# EasyEDA Pro project 无线充电接收端.eprj

# Schematic Schematic1
Board Name: Board1; Create Date: 2023-04-21; Page Name: P1; Project Name: 无线充电接收端; Schematic Name: Schematic1; Update Date: 2025-04-24; Company: 嘉立创EDA; Page Size: A4; Version: V1.0
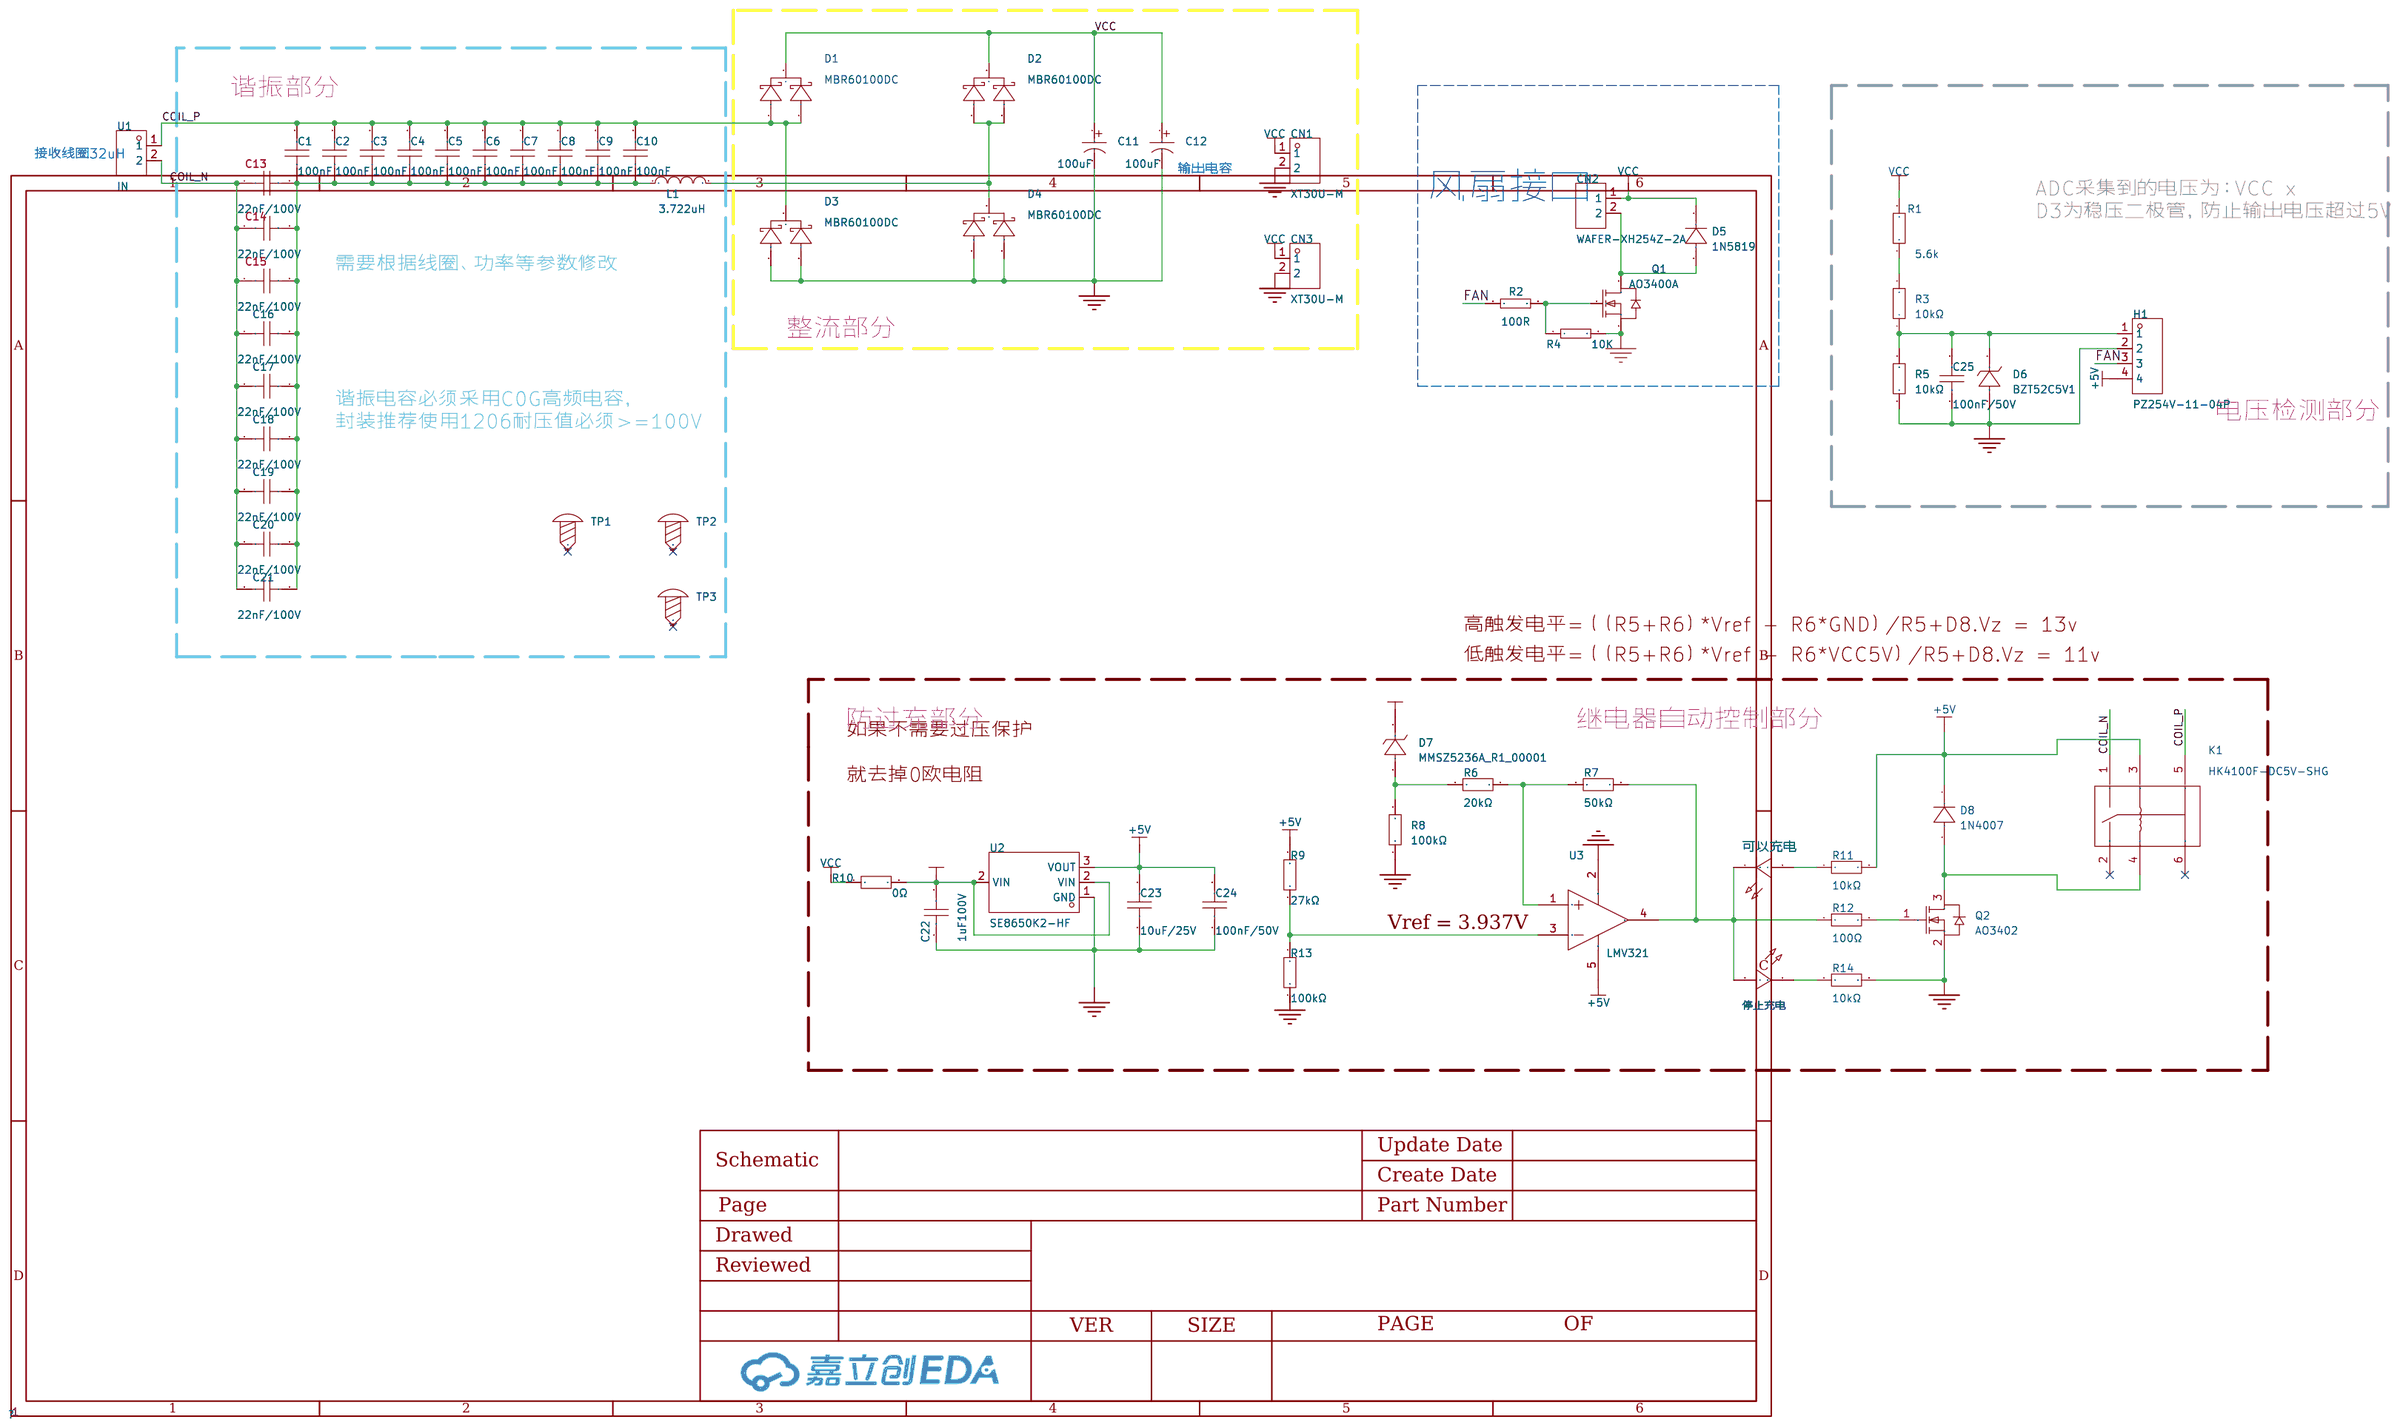
[diagram p0: schematic sheet]

## Parts
C1  100nF  [C1206]
C2  100nF  [C1206]
C3  100nF  [C1206]
C4  100nF  [C1206]
C5  100nF  [C1206]
C6  100nF  [C1206]
C7  100nF  [C1206]
C8  100nF  [C1206]
C9  100nF  [C1206]
C10  100nF  [C1206]
C11  100uF  [CAP-TH_BD10.0-P5.00-D1.0-FD]
C12  100uF  [CAP-TH_BD10.0-P5.00-D1.0-FD]
C13  22nF/100V  [C1206]
C14  22nF/100V  [C1206]
C15  22nF/100V  [C1206]
C16  22nF/100V  [C1206]
C17  22nF/100V  [C1206]
C18  22nF/100V  [C1206]
C19  22nF/100V  [C1206]
C20  22nF/100V  [C1206]
C21  22nF/100V  [C1206]
C22  1uF100V  [C1206]
C23  10uF/25V  [C1206]
C24  100nF/50V  [C0603]
C25  100nF/50V  [C0603]
CN1  XT30U-M  [CONN-TH_XT30U-M]
CN2  WAFER-XH254Z-2A  [CONN-TH_2P-P2.50_XH-2A_3045048]
CN3  XT30U-M  [CONN-TH_XT30U-M]
D1  MBR60100DC  [TO-263-3_L10.2-W9.0-P5.08-LS15.2-BR]
D2  MBR60100DC  [TO-263-3_L10.2-W9.0-P5.08-LS15.2-BR]
D3  MBR60100DC  [TO-263-3_L10.2-W9.0-P5.08-LS15.2-BR]
D4  MBR60100DC  [TO-263-3_L10.2-W9.0-P5.08-LS15.2-BR]
D5  1N5819  [SMA_L4.3-W2.6-LS5.1-RD]
D6  BZT52C5V1  [SOD-123_L2.7-W1.6-LS3.7-RD]
D7  MMSZ5236A_R1_00001  [SOD-123F_L2.7-W1.6-LS3.8-RD-1]
D8  1N4007  [SMA_L4.3-W2.5-LS5.0-RD]
H1  PZ254V-11-04P  [HDR-TH_4P-P2.54-V-M]
K1  HK4100F-DC5V-SHG  [RELAY-TH_HK4100F-DC5V-SHG]
L1  3.722uH  [T106-2]
Q1  AO3400A  [SOT-23-3_L2.9-W1.3-P1.90-LS2.4-BR]
Q2  AO3402  [SOT-23-3_L3.0-W1.7-P0.95-LS2.9-BR]
R1  5.6k  [R0603]
R2  100R  [R0603]
R3  10kΩ  [R0603]
R4  10K  [R0603]
R5  10kΩ  [R0603]
R6  20kΩ  [R0603]
R7  50kΩ  [R0603]
R8  100kΩ  [R0603]
R9  27kΩ  [R0603]
R10  0Ω  [R0603]
R11  10kΩ  [R0603]
R12  100Ω  [R0603]
R13  100kΩ  [R0603]
R14  10kΩ  [R0603]
TP1  -  [孔]
TP2  -  [孔]
TP3  -  [孔]
U1  IN  [CONN-TH_P5.00_KF301-5.0-2P]
U2  SE8650K2-HF  [SOT-89-3_L4.5-W2.5-P1.50-LS4.2-BR]
U3  LMV321  [SOT-23-5_L3.0-W1.5-P0.80-LS3.0-BL]
停止充电  -  [LED_0603]
可以充电  -  [LED_0603]

## Library data of the parts
C1-C10 = GRM31C5C2A104JA01L: 容值:100nF;精度:±5%;额定电压:100V;材质(温度系数):C0G;; LCSC Part Name: 100nF ±5% 100V; Supplier Part: C405303; Manufacturer: muRata(村田); Supplier Footprint: 1206; JLCPCB Part Class: Extended Part; Datasheet: https://atta.szlcsc.com/upload/public/pdf/source/20190717/C405303_DB26B790B590E67035A9C43E8E89903F.pdf; Supplier: LCSC; Tolerance: ±5%; Voltage Rated: 100V; Temperature Coefficient: C0G
C11 C12 = 100PX100MEFC10X16: 容值:100uF;精度:±20%;额定电压:100V;纹波电流:400mA@100kHz;等效串联电阻:-;; LCSC Part Name: 100uF ±20% 100V; Supplier Part: C88775; Manufacturer: rubycon(红宝石); Supplier Footprint: 插件,D10xL16mm; JLCPCB Part Class: Extended Part; Datasheet: https://atta.szlcsc.com/upload/public/pdf/source/20161125/1480067888294.pdf; Supplier: LCSC; Tolerance: ±20%; Rated Voltage: 100V; φD: 10mm; L: 16mm; Lead Spacing: 5mm; Ripple Current: 400mA@100kHz; Lifetime @ Temp: 2000hrs@105℃
C13-C21 = GRM31C5C2A104JA01L: 容值:100nF;精度:±5%;额定电压:100V;材质(温度系数):C0G;; LCSC Part Name: 100nF ±5% 100V; Supplier Part: C405303; Manufacturer: muRata(村田); Supplier Footprint: 1206; JLCPCB Part Class: Extended Part; Datasheet: https://atta.szlcsc.com/upload/public/pdf/source/20190717/C405303_DB26B790B590E67035A9C43E8E89903F.pdf; Supplier: LCSC; Tolerance: ±5%; Voltage Rated: 100V; Temperature Coefficient: C0G; Check: false
C22 = CL31B105KCHNNNE: 容值:1uF;精度:±10%;额定电压:100V;材质(温度系数):X7R;; LCSC Part Name: 1uF ±10% 100V; Supplier Part: C13832; Manufacturer: SAMSUNG(三星); Supplier Footprint: 1206; JLCPCB Part Class: Extended Part; Datasheet: https://atta.szlcsc.com/upload/public/pdf/source/20160103/1457707669218.pdf; Supplier: LCSC; Tolerance: ±10%; Voltage Rated: 100V; Temperature Coefficient: X7R
C23 = CL31A106KAHNNNE: 容值:10uF;精度:±10%;额定电压:25V;材质(温度系数):X5R;; LCSC Part Name: 10uF ±10% 25V; Supplier Part: C9807; Manufacturer: SAMSUNG(三星); Supplier Footprint: 1206; JLCPCB Part Class: Extended Part; Datasheet: https://atta.szlcsc.com/upload/public/pdf/source/20160103/1457707744674.pdf; Supplier: LCSC; Tolerance: ±10%; Voltage Rated: 25V; Temperature Coefficient: X5R
C24 C25 = CL31B104KBCNNNC: 容值:100nF;精度:±10%;额定电压:50V;材质(温度系数):X7R;; LCSC Part Name: 100nF ±10% 50V; Supplier Part: C24497; Manufacturer: SAMSUNG(三星); Supplier Footprint: 1206; JLCPCB Part Class: Basic Part; Datasheet: https://atta.szlcsc.com/upload/public/pdf/source/20160103/1457707712356.pdf; Supplier: LCSC; Tolerance: ±10%; Voltage Rated: 50V; Temperature Coefficient: X7R
CN1 CN3 = XT30U-M: LCSC Part Name: AMASS(艾迈斯)轻量版锂电池插头公头 XT30U-M; Supplier Part: C99101; Manufacturer: AMASS(艾迈斯); JLCPCB Part Class: 扩展库; Datasheet: https://atta.szlcsc.com/upload/public/pdf/source/20170606/1496716542582.pdf; Supplier: LCSC; Brand: 艾迈斯; Type: 插头; Colour: 黄色; InterfaceType: 公头
CN2 = WAFER-XH254Z-2A: 插针结构:1x2P;间距:2.54mm;安装方式:直插;参考系列:XH;总PIN数:2P;排数:1;每排PIN数:2;额定电流:3A;工作温度范围:-25℃~+85℃;; Supplier Part: C7432682; Manufacturer: HANBO(汉博); Supplier Footprint: 插件,P=2.5mm; JLCPCB Part Class: 扩展库; Datasheet: https://atta.szlcsc.com/upload/public/pdf/source/20230718/3B4FABA5D38EFB02DAF74E7C2B33D98F.pdf; Supplier: LCSC; Pins Structure: 1x2P; Pitch: 2.54mm; Mounting Style: 直插; Reference Series: XH; Number of Pins: 2P; Number of Rows: 1; Number of PINs Per Row: 2; Current Rating (Max): 3A; Operating Temperature Range: -25℃~+85℃
D1-D4 = MBR60100DC: LCSC Part Name: 电压:100V 电流:60A; Supplier Part: C6069541; Manufacturer: YFW(佑风微); Supplier Footprint: TO-263; JLCPCB Part Class: 扩展库; Datasheet: https://atta.szlcsc.com/upload/public/pdf/source/20240112/872A04BCA0949E3C2EEA888B39E50EE6.pdf; Supplier: LCSC; Voltage - Forward(Vf@If): 840mV@30A; Voltage - DC Reverse(Vr): 100V; Current - Rectified: 60A; Reverse Leakage Current (Ir): 3mA@100V
D5 = 1N5819: Supplier Part: C9900008009; JLCPCB Part Class: 扩展库; Supplier: LCSC
D6 = BZT52C5V1_C19077401: Supplier Part: C19077401; Manufacturer: 宏迦橙; Supplier Footprint: SOD-123; JLCPCB Part Class: 扩展库; Datasheet: https://atta.szlcsc.com/upload/public/pdf/source/20241104/A31DF82E6D0CBEC29199D0B62829516E.pdf; Supplier: LCSC; Diode Configuration: 独立式; Zener Voltage (Nom): 5.1V; Reverse Leakage Current (Ir): 2uA@2V; Zener Voltage (Range): 4.85V~5.36V; Power Dissipation: 500mW; Zener Impedance (Zzt): 60Ω
D7 = MMSZ5236A_R1_00001: 二极管配置:独立式;稳压值(标称值):7.5V;稳压值(范围):7.35V~7.65V;精度:-;功率:500mW;; Supplier Part: C391552; Manufacturer: PANJIT(强茂); Supplier Footprint: SOD-123; JLCPCB Part Class: Extended Part; Datasheet: https://atta.szlcsc.com/upload/public/pdf/source/20200320/C391552_8ABD86AFAF65E95A92FC2A524616D46B.pdf; Supplier: LCSC; Diode Configuration: 独立式; Zener Voltage (Nom): 7.5V; Zener Voltage (Range): 7.35V~7.65V; Power Dissipation: 500mW; Reverse Leakage Current (Ir): 3uA@6V; Zener Impedance (Zzt): 6Ω
D8 = 1N4007_C727081: 二极管配置:独立式;直流反向耐压(Vr):1kV;平均整流电流(Io):1A;正向压降(Vf):1.1V@1A;反向电流(Ir):5uA@1kV;; LCSC Part Name: 1kV 1A 1.1V@1A; Supplier Part: C727081; Manufacturer: TWGMC(台湾迪嘉); Supplier Footprint: SMA(DO-214AC); JLCPCB Part Class: Extended Part; Datasheet: https://atta.szlcsc.com/upload/public/pdf/source/20200828/C727079_3A05254382567072883400655AE0ED46.pdf; Supplier: LCSC; Diode Configuration: 独立式; Reverse Voltage (Vr): 1kV; Average Rectified Current (Io): 1A; Forward Voltage (Vf@If): 1.1V@1A; Reverse Leakage Current: 5uA@1kV
H1 = PZ254V-11-04P: LCSC Part Name: 间距:2.54mm 1x4P 直插 方针; Supplier Part: C2691448; Manufacturer: XFCN(兴飞); Supplier Footprint: 插件,P=2.54mm; JLCPCB Part Class: 扩展库; Datasheet: https://atta.szlcsc.com/upload/public/pdf/source/20200309/C492403_F9F19131791D08044AD4F84F8E751A34.pdf; Supplier: LCSC; Pin Structure: 1x4P; Pitch: 2.54mm; Circluar Pins/Square Pins: 方针; Mounting Type: 直插; Number of Rows: 单排; Number of Pins: 4P; Current Rating (Max): 3A; Voltage Rating (Max): 250V; Length of Mating Pin: 6mm; Insulation Height: 2.5mm; Length of End Connection Pin: 3mm; Operating Temperature Range: -40℃~+105℃; Color: 黑色
K1 = HK4100F-DC5V-SHG: Supplier Part: C12072; Manufacturer: 汇科; Supplier Footprint: DIP,10.5x14.5mm; JLCPCB Part Class: 扩展库; Datasheet: https://atta.szlcsc.com/upload/public/pdf/source/20180316/5A66D26635AF047552DED4727B242686.pdf; Supplier: LCSC
L1 = B82477P4473M000: 类型:-;电感值:47uH;精度:±20%;额定电流:-;饱和电流(Isat):3.7A;; LCSC Part Name: 47uH ±20% 55.2mΩ; Supplier Part: C3018561; Manufacturer: TDK; Supplier Footprint: SMD,12.5x12.5mm; JLCPCB Part Class: Extended Part; Datasheet: https://atta.szlcsc.com/upload/public/pdf/source/20210701/315E7CE029136F7ACE71B9D1C928327E.pdf; Supplier: LCSC; Tolerance: ±20%; Saturation Current (Isat): 3.7A; DC Resistance (DCR): 55.2mΩ; Check: false
Q1 = AO3400A_C347475: LCSC Part Name: 1个N沟道 耐压:30V 电流:5.8A; Supplier Part: C347475; Manufacturer: UMW(友台半导体); Supplier Footprint: SOT-23; JLCPCB Part Class: 扩展库; Datasheet: https://atta.szlcsc.com/upload/public/pdf/source/20231109/50AB4FB4D66E55864F9B8D027B723C9A.pdf; Supplier: LCSC; Type: 1个N沟道; Drain Source Voltage (Vdss): 30V; Continuous Drain Current (Id): 5.8A; Drain Source On Resistance (RDS(on)@Vgs,Id): 28mΩ@10V,5.8A; Power Dissipation (Pd): 1.4W; Gate Threshold Voltage (Vgs(th)@Id): 1.4V@250uA; Total Gate Charge (Qg@Vgs): 12nC@10V; Input Capacitance (Ciss@Vds): 1.05nF@24V; Reverse Transfer Capacitance (Crss@Vds): 77pF@15V; Operating Temperature: -55℃~+150℃
Q2 = AO3402_C351406: 类型:N沟道;漏源电压(Vdss):30V;连续漏极电流(Id):4A;功率(Pd):1.4W;导通电阻(RDS(on)@Vgs,Id):55mΩ@10V,4A;阈值电压(Vgs(th)@Id):1.4V@250uA;; LCSC Part Name: N沟道 30V 4A; Supplier Part: C351406; Manufacturer: PUOLOP(迪浦); Supplier Footprint: SOT-23-3L; JLCPCB Part Class: Extended Part; Datasheet: https://atta.szlcsc.com/upload/public/pdf/source/20190109/C351406_0F7A9BF69087AA6A27B93DC50EDBF819.pdf; Supplier: LCSC; Type: N沟道; Drain Source Voltage (Vdss): 30V; Continuous Drain Current (Id): 4A; Power Dissipation (Pd): 1.4W; Drain Source On Resistance (RDS(on)@Vgs,Id): 55mΩ@10V,4A; Gate Threshold Voltage (Vgs(th)@Id): 1.4V@250uA
R1 R8 R13 = 0805W8F1003T5E: 电阻类型:厚膜电阻;阻值:100kΩ;精度:±1%;功率:125mW;; LCSC Part Name: 100kΩ ±1% 125mW; Supplier Part: C149504; Manufacturer: UNI-ROYAL(厚声); Supplier Footprint: 0805; JLCPCB Part Class: Basic Part; Datasheet: https://atta.szlcsc.com/upload/public/pdf/source/20200306/C422600_1E6D84923E4A46A82E41ADD87F860B5C.pdf; Supplier: LCSC; Type: 厚膜电阻; Tolerance: ±1%; Power(Watts): 125mW; Temperature Coefficient: ±100ppm/℃; Overload Voltage (Max): 150V; Operating Temperature Range: -55℃~+155℃
R2 = =Value+' '+Tolerance: 贴片电阻; Revision: V1.0; Tolerance: ±1%; Origin Footprint 2: RESC0603[0201]-L; Origin Footprint 3: RESC0603[0201]-M; Origin Footprint 4: RESC0603[0201]-N; Origin Footprint 5: RESC0603[0201]S-L; Origin Footprint 6: RESC0603[0201]S-M; Origin Footprint 7: RESC0603[0201]S-N; Origin Footprint 8: RESC1005[0402]-L; Origin Footprint 9: RESC1005[0402]-M; Origin Footprint 10: RESC1005[0402]-N; Origin Footprint 11: RESC1005[0402]S-L; Origin Footprint 12: RESC1005[0402]S-M; Origin Footprint 13: RESC1005[0402]S-N; Origin Footprint 14: RESC1608[0603]-L; Origin Footprint 15: RESC1608[0603]-M; Origin Footprint 16: RESC1608[0603]-N; Origin Footprint 17: RESC1608[0603]S-L; Origin Footprint 18: RESC1608[0603]S-M; Origin Footprint 19: RESC2012[0805]; Origin Footprint 20: RESC2012[0805]S-L; Origin Footprint 21: RESC2012[0805]S-M; Origin Footprint 22: RESC2012[0805]S-N; Origin Footprint 23: RESC3216[1206]; Origin Footprint 24: RESC3216[1206]S-L; Origin Footprint 25: RESC3216[1206]S-M; Origin Footprint 26: RESC3216[1206]S-N; Origin Footprint 27: RESC3225[1210]; Origin Footprint 28: RESC3225[1210]S; Origin Footprint 29: RESC5025[2010]; Origin Footprint 30: RESC5025[2010]S; Origin Footprint 31: RESC6332[2512]; Origin Footprint 32: RESC6332[2512]S; Origin Footprint 33: RESC0402[01005]-L; Origin Footprint 1: RESC1608[0603]S-N; Design Item ID: Res-Chip_1; Library Name: WirelessChargingHost_HBridge
R3 R5 R11 R14 = 0805W8F1002T5E_C17414: 电阻类型:厚膜电阻;阻值:10kΩ;精度:±1%;功率:125mW;; LCSC Part Name: 10kΩ ±1% 125mW; Supplier Part: C17414; Manufacturer: UNI-ROYAL(厚声); Manufacturer Part: 0805W8F1002T5E; Supplier Footprint: 0805; JLCPCB Part Class: Basic Part; Datasheet: https://atta.szlcsc.com/upload/public/pdf/source/20200306/C422600_1E6D84923E4A46A82E41ADD87F860B5C.pdf; Supplier: LCSC; Type: 厚膜电阻; Tolerance: ±1%; Power(Watts): 125mW; Temperature Coefficient: ±100ppm/℃; Overload Voltage (Max): 150V; Operating Temperature Range: -55℃~+155℃
R4 = =Value+' '+Tolerance: 贴片电阻; Revision: V1.0; Tolerance: ±1%; Origin Footprint 2: RESC0603[0201]-L; Origin Footprint 3: RESC0603[0201]-M; Origin Footprint 4: RESC0603[0201]-N; Origin Footprint 5: RESC0603[0201]S-L; Origin Footprint 6: RESC0603[0201]S-M; Origin Footprint 7: RESC0603[0201]S-N; Origin Footprint 8: RESC1005[0402]-L; Origin Footprint 9: RESC1005[0402]-M; Origin Footprint 10: RESC1005[0402]-N; Origin Footprint 11: RESC1005[0402]S-L; Origin Footprint 12: RESC1005[0402]S-M; Origin Footprint 13: RESC1005[0402]S-N; Origin Footprint 14: RESC1608[0603]-L; Origin Footprint 15: RESC1608[0603]-M; Origin Footprint 16: RESC1608[0603]-N; Origin Footprint 17: RESC1608[0603]S-L; Origin Footprint 18: RESC1608[0603]S-M; Origin Footprint 19: RESC2012[0805]; Origin Footprint 20: RESC2012[0805]S-L; Origin Footprint 21: RESC2012[0805]S-M; Origin Footprint 22: RESC2012[0805]S-N; Origin Footprint 23: RESC3216[1206]; Origin Footprint 24: RESC3216[1206]S-L; Origin Footprint 25: RESC3216[1206]S-M; Origin Footprint 26: RESC3216[1206]S-N; Origin Footprint 27: RESC3225[1210]; Origin Footprint 28: RESC3225[1210]S; Origin Footprint 29: RESC5025[2010]; Origin Footprint 30: RESC5025[2010]S; Origin Footprint 31: RESC6332[2512]; Origin Footprint 32: RESC6332[2512]S; Origin Footprint 33: RESC0402[01005]-L; Origin Footprint 1: RESC1608[0603]S-N; Design Item ID: Res-Chip; Library Name: WirelessChargingHost_HBridge
R6 = 0805W8F2002T5E: 电阻类型:厚膜电阻;阻值:20kΩ;精度:±1%;功率:125mW;; LCSC Part Name: 20kΩ ±1% 125mW; Supplier Part: C4328; Manufacturer: UNI-ROYAL(厚声); Supplier Footprint: 0805; JLCPCB Part Class: Basic Part; Datasheet: https://atta.szlcsc.com/upload/public/pdf/source/20200306/C422600_1E6D84923E4A46A82E41ADD87F860B5C.pdf; Supplier: LCSC; Type: 厚膜电阻; Tolerance: ±1%; Power(Watts): 125mW; Temperature Coefficient: ±100ppm/℃; Overload Voltage (Max): 150V; Operating Temperature Range: -55℃~+155℃
R7 = ARG05DTC5002: 电阻类型:薄膜电阻;阻值:50kΩ;精度:±0.5%;功率:125mW;; LCSC Part Name: 50kΩ ±0.5% 125mW; Supplier Part: C2828840; Manufacturer: Viking(光颉); Supplier Footprint: 0805; JLCPCB Part Class: Extended Part; Datasheet: https://atta.szlcsc.com/upload/public/pdf/source/20210426/C2828737_35D2DDB0BDDA00747C2712435E28BBD4.pdf; Supplier: LCSC; Type: 薄膜电阻; Tolerance: ±0.5%; Power(Watts): 125mW; Temperature Coefficient: ±25ppm/℃; Overload Voltage (Max): 150V; Operating Temperature Range: -55℃~+155℃
R9 = ERJ6GEYJ273V: 电阻类型:厚膜电阻;阻值:27kΩ;精度:±5%;功率:125mW;; LCSC Part Name: 27kΩ ±5% 125mW; Supplier Part: C413205; Manufacturer: PANASONIC(松下); Supplier Footprint: 0805; JLCPCB Part Class: Extended Part; Datasheet: https://atta.szlcsc.com/upload/public/pdf/source/20190820/C413205_6CCE5417FAC6A01C3AE94FC74080579C.pdf; Supplier: LCSC; Type: 厚膜电阻; Tolerance: ±5%; Power(Watts): 125mW; Temperature Coefficient: ±200ppm/℃; Operating Temperature Range: -55℃~+155℃
R10 = 1206W4J0000T5E: 电阻类型:厚膜电阻;阻值:0Ω;精度:±5%;功率:250mW;; LCSC Part Name: 0Ω ±5% 250mW; Supplier Part: C19290; Manufacturer: UNI-ROYAL(厚声); Supplier Footprint: 1206; JLCPCB Part Class: Extended Part; Datasheet: https://atta.szlcsc.com/upload/public/pdf/source/20200306/C422600_1E6D84923E4A46A82E41ADD87F860B5C.pdf; Supplier: LCSC; Type: 厚膜电阻; Tolerance: ±5%; Power(Watts): 250mW; Overload Voltage (Max): 200V; Operating Temperature Range: -55℃~+155℃
R12 = ERJ6RBD1000V: 阻值:100Ω;精度:±0.5%;功率:100mW;; LCSC Part Name: 100Ω ±0.5% 100mW; Supplier Part: C336854; Manufacturer: PANASONIC(松下); Supplier Footprint: 0805; JLCPCB Part Class: Extended Part; Datasheet: https://atta.szlcsc.com/upload/public/pdf/source/20190227/C336854_3769CE358E33F042049D69C9EE9D80A7.pdf; Supplier: LCSC; Tolerance: ±0.5%; Power(Watts): 100mW; Temperature Coefficient: ±50ppm/℃; Operating Temperature Range: -55℃~+155℃
TP1-TP3 = M2螺丝: Supplier Footprint: 插件
U1 = KF301-5.0-2P: 间距:5mm;排数:1;每排PIN数:2;安装方式:直针;额定电流:17A;额定电压:250V;线规 - AWG:14~22;线规 - mm?:1.5;工作温度范围:-30℃~+120℃;颜色:蓝色;; LCSC Part Name: 5mm 排数:1 每排P数:2 直针 可拼接 铜 环保; Supplier Part: C474881; Manufacturer: KEFA(科发); Supplier Footprint: 直插,P=5mm; JLCPCB Part Class: Extended Part; Datasheet: https://atta.szlcsc.com/upload/public/pdf/source/20200115/C474881_883EFE2003339C40FD1BEEEFC9A18423.pdf; Supplier: LCSC; Pitch: 5mm; Number of Rows: 1; Number of PINs Per Row: 2; Mounting Style: 直针; Current Rating (Max): 17A; Voltage Rating (Max): 250V; Wire Gauge - AWG: 14~22; Wire Gauge - mm?: 1.5; Operating Temperature Range: -30℃~+120℃; Color: 蓝色; Check: false
U2 = SE8650K2-HF: 输出类型:固定;输出极性:正;最大输入电压:80V;输出电压:5V;输出电流:-;电源纹波抑制比(PSRR):85dB;; Supplier Part: C496616; Manufacturer: SEAWARD(思旺); Supplier Footprint: SOT-89-3; JLCPCB Part Class: Extended Part; Datasheet: https://atta.szlcsc.com/upload/public/pdf/source/20220321/29E2D6E65CE42ECBE76E8EC1E13AE65C.pdf; Supplier: LCSC; Output Type: 固定; Output Polarity: 正; Number of Outputs: 1; Maximum Input Voltage: 80V; Output Voltage: 5V; Quiescent Current (Ground Current): 2uA; Power Supply Rejection Ratio (PSRR): 85dB
U3 = LMV321_C395459: 运放类型:-;放大器组数:-;增益带宽积（GBP）:-;压摆率（SR）:-;电源电压:-;各通道供电电流:-;; Supplier Part: C395459; Manufacturer: IDCHIP(英锐芯); Supplier Footprint: SOT23-5; JLCPCB Part Class: Extended Part; Datasheet: https://atta.szlcsc.com/upload/public/pdf/source/20190617/C395459_2DAC95FD8A47E8EE98552DFC8CF3610C.pdf; Supplier: LCSC
停止充电 = LED_0805-G: Supplier Footprint: 0805; Check: false
可以充电 = LED_0805-R: Supplier Footprint: 0805; Check: false

## Nets
+5V: C23.2 C24.2 D8.1(K) H1.4 K1.3 R9.2 R11.2 U2.3(VOUT) U3.5(VCC+)
GND: C11.2 C12.2 C22.1 C23.1 C24.1 C25.1 CN1.2 CN3.2 D3.1(A) D3.3(A) D4.1(A) D4.3(A) D6.2(A) H1.2 Q1.2(S) Q2.2(S) R4.2 R5.1 R8.1 R13.1 R14.2 U2.1(GND) U3.2(GND)
VCC: C11.1 C12.1 CN1.1 CN2.1 CN3.1 D1.2(K) D2.2(K) D5.1(K) R1.2 R10.1
VCCO: C22.2 D7.1(K) R10.2 U2.2(VIN)
COIL_N: C13.1 C14.1 C15.1 C16.1 C17.1 C18.1 C19.1 C20.1 C21.1 K1.1 U1.2
COIL_P: C1.2 C2.2 C3.2 C4.2 C5.2 C6.2 C7.2 C8.2 C9.2 C10.2 D1.1(A) D1.3(A) D3.2(K) K1.5 U1.1
FAN: H1.3 R2.1
$1N1844: C1.1 C2.1 C3.1 C4.1 C5.1 C6.1 C7.1 C8.1 C9.1 C10.1 C13.2 C14.2 C15.2 C16.2 C17.2 C18.2 C19.2 C20.2 C21.2 L1.1
$1N2254: R9.1 R13.2 U3.3(IN-)
$1N2260: D7.2(A) R6.2 R8.2
$1N2269: R6.1 R7.2 U3.1(IN+)
$1N2296: R7.1 R12.1 U3.4(OUT) 停止充电.2(A) 可以充电.1(C)
$1N2299: R14.1 停止充电.1(C)
$1N2308: Q2.1(G) R12.2
$1N2311: R11.1 可以充电.2(A)
$1N2460: D8.2(A) K1.4 Q2.3(D)
$1N22646: C25.2 D6.1(K) H1.1 R3.1 R5.2
$1N54290: R1.1 R3.2
$1N85464: D2.1(A) D2.3(A) D4.2(K) L1.2
$1N94718: Q1.1(G) R2.2 R4.1
$1N94842: CN2.2 D5.2(A) Q1.3(D)

Not connected (* = marked no-connect by the designer): K1 2* 6*; TP1 1*; TP2 1*; TP3 1*

## Notes on the sheet
- 谐振部分
- 接收线圈32uH
- 输出电容
- 风扇接口
- ADC采集到的电压为：VCC x
  D3为稳压二极管，防止输出电压超过5V
- 需要根据线圈、功率等参数修改
- 整流部分
- 电压检测部分
- 谐振电容必须采用C0G高频电容，
  封装推荐使用1206耐压值必须>=100V
- 高触发电平=（（R5+R6）*Vref - R6*GND）/R5+D8.Vz = 13v
- 低触发电平=（（R5+R6）*Vref - R6*VCC5V）/R5+D8.Vz = 11v
- 防过充部分
- 继电器自动控制部分
- 如果不需要过压保护
  就去掉0欧电阻
- Vref = 3.937V

# Board PCB1
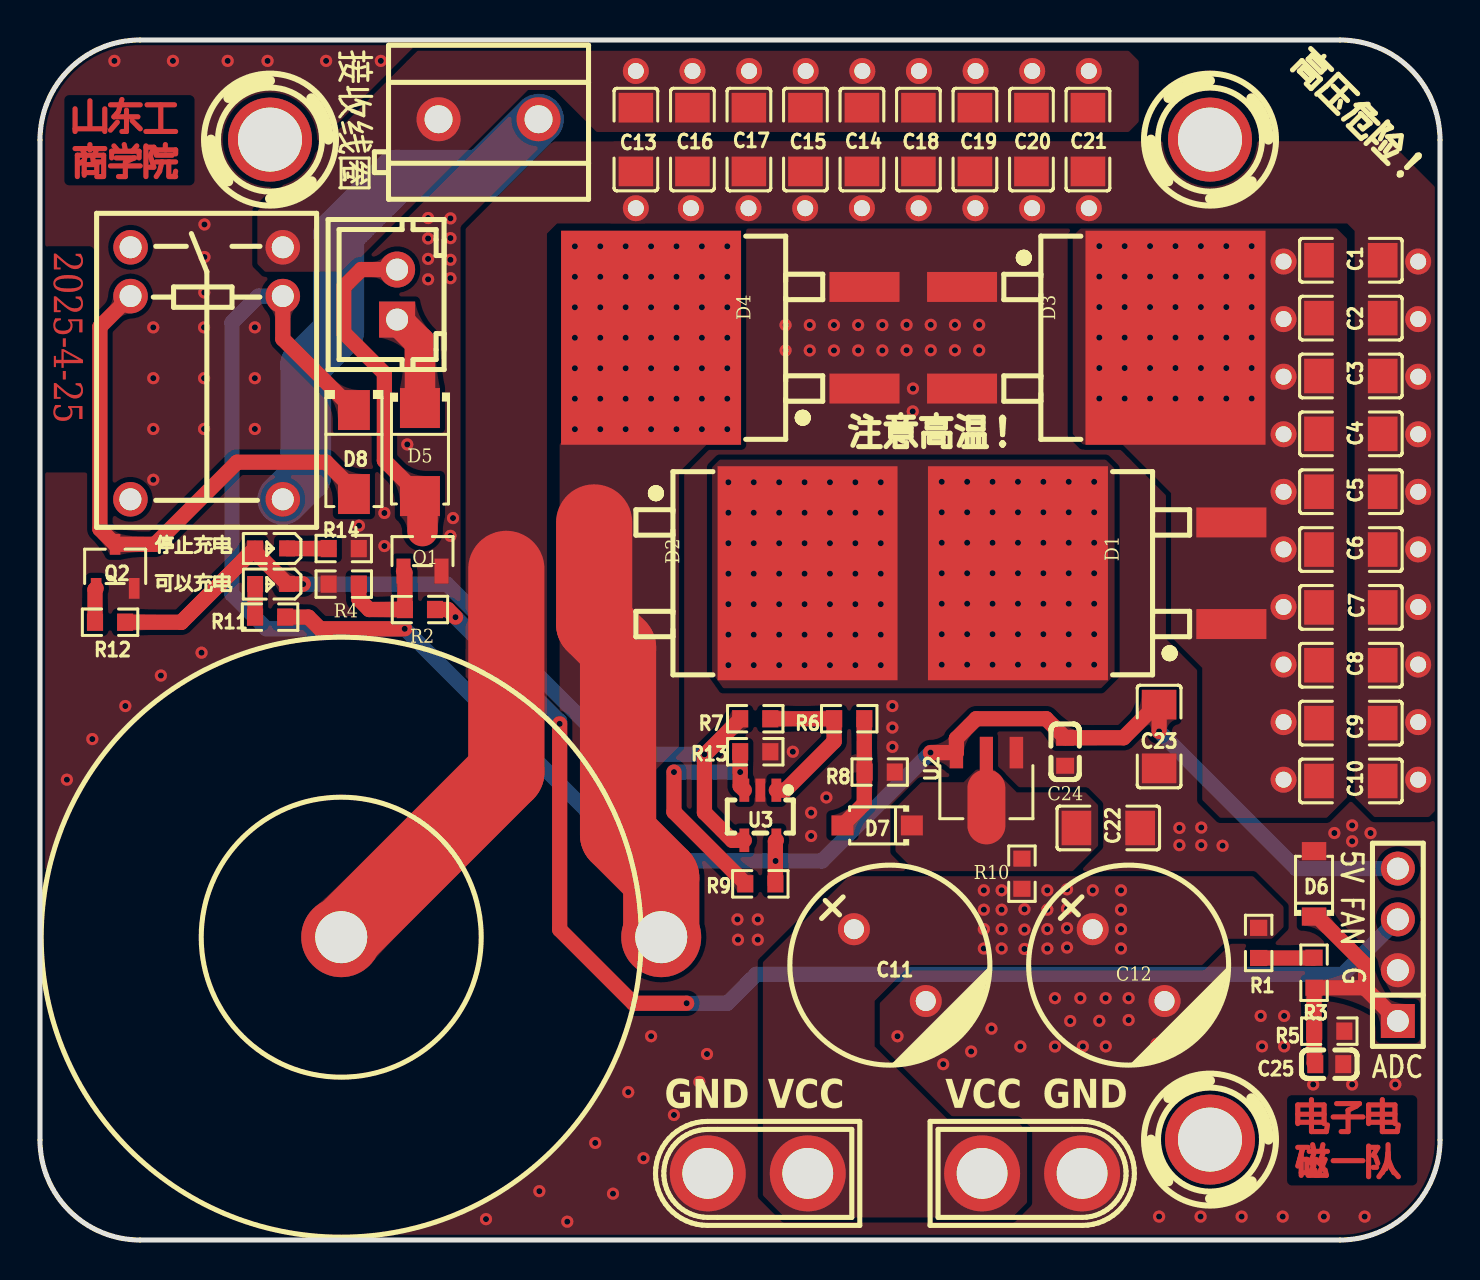
[diagram p1: board, top side]
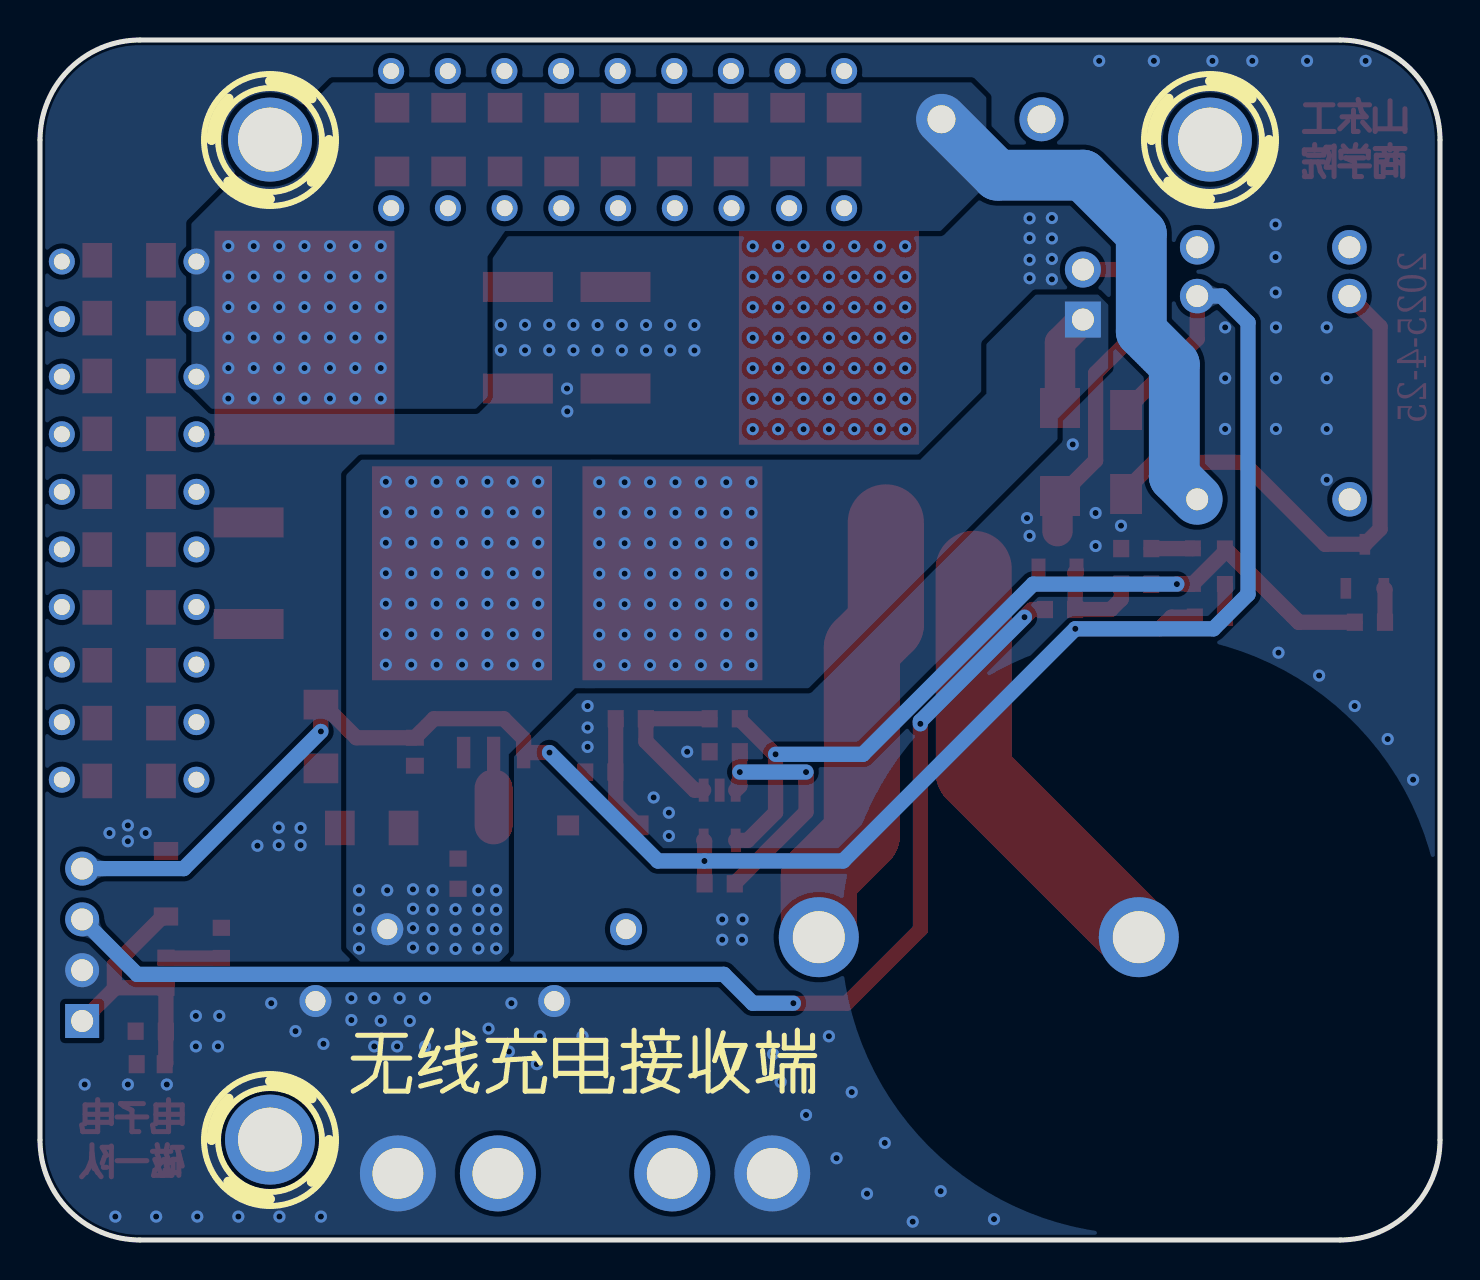
[diagram p2: board, bottom side, seen from below]

Outline 70 x 60 mm; copper layers: Top Layer, Bottom Layer. Coordinates in mm from the lower left corner of the outline.
Outline path: 0,55 0,5 arc(1.46,1.46) 5,0 65,0 arc(68.54,1.46) 70,5 70,55 arc(68.54,58.54) 65,60 5,60 arc(1.46,58.54) 0,55
Stack: Top Layer 0.035mm / Dielectric1 1.51mm FR4 er 4.5 / Bottom Layer 0.035mm

## Design rules (mm)
template: 自定义配置
spacing copperThickness1oz (default): track to track 0.102, other pairs 0.152 to 0.3
spacing copperThickness2oz: track to track 0.203, other pairs 0.152 to 0.3
track width copperThickness1oz (default): min 0.127, default 0.254, max 3.81
track width copperThickness2oz: min 0.203, default 0.254, max 2.54
differential pair differentialPair (default): width min 0.127, default 0.254, max 2.54; gap min 0.152, default 0.152
via viaSize (default): diameter min 0.5, default 0.61, max 10; hole min 0.3, default 0.305, max 6.3

## Placement (name value [footprint] x y rotation side)
C1  100nF  [C1206]  65.54 48.99 180 top
C2  100nF  [C1206]  65.54 46.09 180 top
C3  100nF  [C1206]  65.54 43.2 180 top
C4  100nF  [C1206]  65.54 40.31 180 top
C5  100nF  [C1206]  65.54 37.42 180 top
C6  100nF  [C1206]  65.54 34.52 180 top
C7  100nF  [C1206]  65.54 31.63 180 top
C8  100nF  [C1206]  65.54 28.74 180 top
C9  100nF  [C1206]  65.54 25.84 180 top
C10  100nF  [C1206]  65.54 22.95 180 top
C11  100uF  [CAP-TH_BD10.0-P5.00-D1.0-FD]  42.49 13.74 315 top
C12  100uF  [CAP-TH_BD10.0-P5.00-D1.0-FD]  54.43 13.74 315 top
C13  22nF/100V  [C1206]  29.79 55.02 270 top
C14  22nF/100V  [C1206]  41.1 55.02 270 top
C15  22nF/100V  [C1206]  38.27 55.02 270 top
C16  22nF/100V  [C1206]  32.62 55.02 270 top
C17  22nF/100V  [C1206]  35.45 55.02 270 top
C18  22nF/100V  [C1206]  43.92 55.02 270 top
C19  22nF/100V  [C1206]  46.75 55.02 270 top
C20  22nF/100V  [C1206]  49.57 55.02 270 top
C21  22nF/100V  [C1206]  52.4 55.02 270 top
C22  1uF100V  [C1206]  53.41 20.6 180 top
C23  10uF/25V  [C1206]  55.96 25.17 90 top
C24  100nF/50V  [C0603]  51.26 24.41 90 top
C25  100nF/50V  [C0603]  64.46 8.79 180 top
CN1  XT30U-M  [CONN-TH_XT30U-M]  35.89 3.33 180 top
CN2  WAFER-XH254Z-2A  [CONN-TH_2P-P2.50_XH-2A_3045048]  17.85 47.27 90 top
CN3  XT30U-M  [CONN-TH_XT30U-M]  49.6 3.33 0 top
D1  MBR60100DC  [TO-263-3_L10.2-W9.0-P5.08-LS15.2-BR]  54.23 33.34 0 top
D2  MBR60100DC  [TO-263-3_L10.2-W9.0-P5.08-LS15.2-BR]  33.04 33.34 180 top
D3  MBR60100DC  [TO-263-3_L10.2-W9.0-P5.08-LS15.2-BR]  51.44 45.11 180 top
D4  MBR60100DC  [TO-263-3_L10.2-W9.0-P5.08-LS15.2-BR]  35.89 45.11 0 top
D5  1N5819  [SMA_L4.3-W2.6-LS5.1-RD]  19 39.4 270 top
D6  BZT52C5V1  [SOD-123_L2.7-W1.6-LS3.7-RD]  63.7 17.81 90 top
D7  MMSZ5236A_R1_00001  [SOD-123F_L2.7-W1.6-LS3.8-RD-1]  41.86 20.73 180 top
D8  1N4007  [SMA_L4.3-W2.5-LS5.0-RD]  15.7 39.4 270 top
H1  PZ254V-11-04P  [HDR-TH_4P-P2.54-V-M]  67.89 14.76 90 top
K1  HK4100F-DC5V-SHG  [RELAY-TH_HK4100F-DC5V-SHG]  8.33 43.33 270 top
L1  3.722uH  [T106-2]  15.06 15.14 0 top
NOREF  -  [Pad_e153]  62.18 34.53 0 top
NOREF#2  -  [Pad_e461]  29.79 58.45 90 top
NOREF#3  -  [Pad_e458]  49.6 51.59 90 top
NOREF#4  -  [Pad_e469]  52.44 58.45 90 top
NOREF#5  -  [Pad_e454]  38.26 51.59 90 top
NOREF#6  -  [Pad_e151]  62.18 40.29 0 top
NOREF#7  -  [Pad_e146]  68.91 46.04 0 top
NOREF#8  -  [Pad_e464]  38.29 58.45 90 top
NOREF#9  -  [Pad_e150]  62.18 43.17 0 top
NOREF#10  -  [Pad_e145]  68.91 43.17 0 top
NOREF#11  -  [Pad_e453]  35.42 51.59 90 top
NOREF#12  -  [Pad_e140]  68.91 28.77 0 top
NOREF#13  -  [Pad_e455]  41.1 51.59 90 top
NOREF#14  -  [Pad_e149]  62.18 46.04 0 top
NOREF#15  -  [Pad_e148]  62.18 48.92 0 top
NOREF#16  -  [Pad_e318]  62.18 25.89 0 top
NOREF#17  -  [Pad_e459]  52.44 51.59 90 top
NOREF#18  -  [Pad_e462]  32.62 58.45 90 top
NOREF#19  -  [Pad_e457]  46.77 51.59 90 top
NOREF#20  -  [Pad_e465]  41.12 58.45 90 top
NOREF#21  -  [Pad_e309]  62.18 31.65 0 top
NOREF#22  -  [Pad_e139]  68.91 23.02 0 top
NOREF#23  -  [Pad_e466]  43.95 58.45 90 top
NOREF#24  -  [Pad_e152]  62.18 37.41 0 top
NOREF#25  -  [Pad_e450]  29.79 51.59 90 top
NOREF#26  -  [Pad_e142]  68.91 34.53 0 top
NOREF#27  -  [Pad_e147]  68.91 48.92 0 top
NOREF#28  -  [Pad_e467]  46.78 58.45 90 top
NOREF#29  -  [Pad_e319]  62.18 23.02 0 top
NOREF#30  -  [Pad_e452]  32.54 51.59 90 top
NOREF#31  -  [Pad_e143]  68.91 37.41 0 top
NOREF#32  -  [Pad_e310]  62.18 28.77 0 top
NOREF#33  -  [Pad_e463]  35.46 58.45 90 top
NOREF#34  -  [Pad_e468]  49.61 58.45 90 top
NOREF#35  -  [Pad_e144]  68.91 40.29 0 top
NOREF#36  -  [Pad_e138]  68.91 25.89 0 top
NOREF#37  -  [Pad_e141]  68.91 31.65 0 top
NOREF#38  -  [Pad_e456]  43.93 51.59 90 top
Q1  AO3400A  [SOT-23-3_L2.9-W1.3-P1.90-LS2.4-BR]  19.12 34.44 270 top
Q2  AO3402  [SOT-23-3_L3.0-W1.7-P0.95-LS2.9-BR]  3.76 33.68 270 top
R1  5.6k  [R0603]  60.93 14.85 90 top
R2  100R  [R0603]  19 31.52 180 top
R3  10kΩ  [R0603]  63.7 13.36 90 top
R4  10K  [R0603]  15.19 32.79 180 top
R5  10kΩ  [R0603]  64.46 10.44 180 top
R6  20kΩ  [R0603]  40.46 26.06 0 top
R7  50kΩ  [R0603]  35.76 26.06 0 top
R8  100kΩ  [R0603]  41.99 23.4 180 top
R9  27kΩ  [R0603]  36.02 17.81 0 top
R10  0Ω  [R0603]  49.1 18.32 90 top
R11  10kΩ  [R0603]  11.5 31.14 0 top
R12  100Ω  [R0603]  3.5 30.89 180 top
R13  100kΩ  [R0603]  35.76 24.41 180 top
R14  10kΩ  [R0603]  15.19 34.57 0 top
TP1  -  [孔]  11.5 55 0 top
TP2  -  [孔]  58.5 55 0 top
TP3  -  [孔#2]  58.5 5 0 top
U1  IN  [CONN-TH_P5.00_KF301-5.0-2P]  22.43 56.04 180 top
U2  SE8650K2-HF  [SOT-89-3_L4.5-W2.5-P1.50-LS4.2-BR]  47.32 23.02 90 top
U3  LMV321  [SOT-23-5_L3.0-W1.5-P0.80-LS3.0-BL]  36.02 21.24 180 top
停止充电  -  [LED_0603]  11.5 34.57 180 top
可以充电  -  [LED_0603]  11.5 32.79 180 top

## Footprints (pads in the part's own frame, mm; a bottom-side part is the same pattern mirrored in y, then rotated)
C0603
  rect 0.8x0.9 smd: 1(-0.7,0) 2(0.7,0)
C1206
  rect 1.485x1.728 smd: 1(-1.593,0) 2(1.593,0)
CAP-TH_BD10.0-P5.00-D1.0-FD
  round 1.6 hole 1: 1(-2.54,0) 2(2.54,0)
CONN-TH_2P-P2.50_XH-2A_3045048
  rect 1.8x1.8 hole 1.1: 1(-1.25,0)
  round 1.8 hole 1.1: 2(1.25,0)
CONN-TH_P5.00_KF301-5.0-2P
  round 2.2 hole 1.4: 1(-2.5,0) 2(2.5,0)
CONN-TH_XT30U-M
  round 3.8 hole 2.54: 1(-2.5,0) 2(2.5,0)
HDR-TH_4P-P2.54-V-M
  rect 1.7x1.7 hole 1.1: 1(-3.81,0)
  round 1.7 hole 1.1: 2(-1.27,0) 3(1.27,0) 4(3.81,0)
LED_0603
  rect 0.8x0.8 smd: 1(-0.851,-0.01) 2(0.75,-0.005)
Pad_e138
  round 1.3 hole 0.8: 1(0,0)
Pad_e139
  round 1.3 hole 0.8: 1(0,0)
Pad_e140
  round 1.3 hole 0.8: 1(0,0)
Pad_e141
  round 1.3 hole 0.8: 1(0,0)
Pad_e142
  round 1.3 hole 0.8: 1(0,0)
Pad_e143
  round 1.3 hole 0.8: 1(0,0)
Pad_e144
  round 1.3 hole 0.8: 1(0,0)
Pad_e145
  round 1.3 hole 0.8: 1(0,0)
Pad_e146
  round 1.3 hole 0.8: 1(0,0)
Pad_e147
  round 1.3 hole 0.8: 1(0,0)
Pad_e148
  round 1.3 hole 0.8: 1(0,0)
Pad_e149
  round 1.3 hole 0.8: 1(0,0)
Pad_e150
  round 1.3 hole 0.8: 1(0,0)
Pad_e151
  round 1.3 hole 0.8: 1(0,0)
Pad_e152
  round 1.3 hole 0.8: 1(0,0)
Pad_e153
  round 1.3 hole 0.8: 1(0,0)
Pad_e309
  round 1.3 hole 0.8: 1(0,0)
Pad_e310
  round 1.3 hole 0.8: 1(0,0)
Pad_e318
  round 1.3 hole 0.8: 1(0,0)
Pad_e319
  round 1.3 hole 0.8: 1(0,0)
Pad_e450
  round 1.3 hole 0.8: 1(0,0)
Pad_e452
  round 1.3 hole 0.8: 1(0,0)
Pad_e453
  round 1.3 hole 0.8: 1(0,0)
Pad_e454
  round 1.3 hole 0.8: 1(0,0)
Pad_e455
  round 1.3 hole 0.8: 1(0,0)
Pad_e456
  round 1.3 hole 0.8: 1(0,0)
Pad_e457
  round 1.3 hole 0.8: 1(0,0)
Pad_e458
  round 1.3 hole 0.8: 1(0,0)
Pad_e459
  round 1.3 hole 0.8: 1(0,0)
Pad_e461
  round 1.3 hole 0.8: 1(0,0)
Pad_e462
  round 1.3 hole 0.8: 1(0,0)
Pad_e463
  round 1.3 hole 0.8: 1(0,0)
Pad_e464
  round 1.3 hole 0.8: 1(0,0)
Pad_e465
  round 1.3 hole 0.8: 1(0,0)
Pad_e466
  round 1.3 hole 0.8: 1(0,0)
Pad_e467
  round 1.3 hole 0.8: 1(0,0)
Pad_e468
  round 1.3 hole 0.8: 1(0,0)
Pad_e469
  round 1.3 hole 0.8: 1(0,0)
R0603
  rect 0.806x0.864 smd: 1(-0.753,0) 2(0.753,0)
RELAY-TH_HK4100F-DC5V-SHG
  round 1.727 hole 1.1: 1(-6.301,3.81) 2(-6.301,-3.8) 3(-3.86,3.81) 4(-3.86,-3.803) 5(6.301,3.81) 6(6.301,-3.81)
SMA_L4.3-W2.5-LS5.0-RD
  rect 2x1.593 smd: 1(-2.1,0) 2(2.1,0)
SMA_L4.3-W2.6-LS5.1-RD
  rect 2x2 smd: 1(-2.2,0) 2(2.2,0)
SOD-123_L2.7-W1.6-LS3.7-RD
  rect 0.91x1.22 smd: 1(-1.635,0) 2(1.635,0)
SOD-123F_L2.7-W1.6-LS3.8-RD-1
  rect 1.1x1 smd: 1(-1.735,0) 2(1.735,0)
SOT-23-3_L2.9-W1.3-P1.90-LS2.4-BR
  rect 1.25x0.7 smd: 1(1,-0.95) 2(1,0.95) 3(-1,0)
SOT-23-3_L3.0-W1.7-P0.95-LS2.9-BR
  rect 1.038x0.532 smd: 1(1.101,-0.95) 2(1.101,0.95) 3(-1.101,0)
SOT-23-5_L3.0-W1.5-P0.80-LS3.0-BL
  rect 0.49x1.157 smd: 1(-0.8,-1.254) 2(0,-1.254) 3(0.8,-1.254)
  rect 0.49x1.175 smd: 4(0.8,1.254) 5(-0.8,1.254)
SOT-89-3_L4.5-W2.5-P1.50-LS4.2-BR
  rect 1.575x0.672 smd: 1(1.356,-1.5) 3(1.356,1.5)
  custom 5.377x1.9 smd: 2(-1.356,0)
T106-2
  round 4 hole 2.6: 1(0,0) 2(16,0)
TO-263-3_L10.2-W9.0-P5.08-LS15.2-BR
  rect 3.5x1.5 smd: 1(5.335,-2.54) 3(5.335,2.54)
  rect 9x10.7 smd: 2(-5.335,0)
孔
  round 4.2 hole 3.2: 1(0,0.02)
孔#2
  round 4.5 hole 3.2: 1(0,0.02)

## Nets
As in the schematic, except:
COIL_N: C13.1 C14.1 C15.1 C16.1 C17.1 C18.1 C19.1 C20.1 C21.1 K1.1 NOREF#2.1 NOREF#4.1 NOREF#8.1 NOREF#18.1 NOREF#20.1 NOREF#23.1 NOREF#28.1 NOREF#33.1 NOREF#34.1 U1.2
COIL_P: C1.2 C2.2 C3.2 C4.2 C5.2 C6.2 C7.2 C8.2 C9.2 C10.2 D1.1 D1.3 D3.2 K1.5 NOREF.1 NOREF#6.1 NOREF#9.1 NOREF#14.1 NOREF#15.1 NOREF#16.1 NOREF#21.1 NOREF#24.1 NOREF#29.1 NOREF#32.1 U1.1
$1N1844: C1.1 C2.1 C3.1 C4.1 C5.1 C6.1 C7.1 C8.1 C9.1 C10.1 C13.2 C14.2 C15.2 C16.2 C17.2 C18.2 C19.2 C20.2 C21.2 L1.1 NOREF#3.1 NOREF#5.1 NOREF#7.1 NOREF#10.1 NOREF#11.1 NOREF#12.1 NOREF#13.1 NOREF#17.1 NOREF#19.1 NOREF#22.1 NOREF#25.1 NOREF#26.1 NOREF#27.1 NOREF#30.1 NOREF#31.1 NOREF#35.1 NOREF#36.1 NOREF#37.1 NOREF#38.1

Pads without a net: K1 2 6; TP1 1; TP2 1; TP3 1

## Via types
v1: diameter 0.61, hole 0.305, Top Layer to Bottom Layer, 346 vias

## Routing (per net, layer and track width the routed paths; a pad name or vN(x,y) marks a point on that pad's centre or on a via; arc(x,y) is an arc through that point)
+5V: length 104.7
  Top Layer w0.762: v1(55.96,25.43) C23.2 55.83,26.77 54.18,25.11 C24.2 50.31,26.06 46.81,26.06 45.82,25.07 U2.3 v1(44.53,24.37) ; R11.2 13.42,31.14 14.01,30.56 v1(18.24,30.56) ; U3.5 36.77,19.94 R9.2 ; K1.3 12.14,45.05 D8.1
  Bottom Layer w0.762: v1(55.96,25.43) 62.81,18.57 H1.4 ; v1(44.53,24.37) 39.1,18.95 v1(36.78,18.95) 29.84,18.95 v1(18.24,30.56) 11.33,30.56 9.6,32.29 9.6,45.88 10.92,47.19 K1.3
GND:
  vias: v1(1.34,23.02) v1(2.61,25.05) v1(3.72,58.96) v1(4.27,26.7) v1(5.66,45.63) v1(5.66,43.09) v1(5.66,40.55) v1(5.66,38.01) v1(6.04,28.22) v1(6.65,58.96) v1(8.08,29.36) v1(8.22,50.78) v1(8.22,49.15) v1(8.21,47.38) v1(8.2,45.63) v1(8.2,43.09) v1(8.2,40.55) v1(9.38,58.96) v1(10.74,45.63) v1(10.74,43.09) v1(10.74,40.55) v1(11.38,58.96) v1(14.31,58.96) v1(15.95,35.72) v1(17.04,58.96) v1(17.22,36.35) v1(17.22,34.7) v1(18.36,39.78) v1(19.41,51.1) v1(19.41,50.08) v1(19.41,49.06) v1(19.41,48.03) v1(20.52,51.08) v1(20.52,50.09) v1(20.52,49.01) v1(20.52,48.09) v1(20.52,35.21) v1(20.65,36.1) v1(22.3,1.04) v1(24.97,2.44) v1(26.36,0.92) v1(27.76,4.85) v1(28.65,2.31) v1(29.41,7.39) v1(30.17,4.09) v1(30.56,10.19) v1(31.7,6.25) v1(32.97,7.9) v1(33.35,9.3) v1(34.87,16.03) v1(34.9,15.01) v1(35.89,16.03) v1(35.89,15.01) v1(37.28,45.75) v1(37.28,44.48) v1(37.64,24.41) v1(38.49,45.75) v1(38.49,44.48) v1(38.56,21.36) v1(38.56,20.2) v1(39.32,22.13) v1(39.7,45.75) v1(39.7,44.48) v1(40.91,45.75) v1(40.91,44.48) v1(42.12,45.75) v1(42.12,44.48) v1(42.62,26.7) v1(42.62,25.62) v1(42.62,24.66) v1(42.87,10.19) v1(43.33,45.76) v1(43.33,44.49) v1(43.65,42.57) v1(43.64,41.43) v1(44.54,45.76) v1(44.54,44.49) v1(45.01,10.19) v1(45.16,8.79) v1(45.75,45.76) v1(45.75,44.49) v1(46.43,11.84) v1(46.56,9.43) v1(46.96,45.76) v1(46.96,44.49) v1(47.57,10.57) v1(49.02,9.68) v1(50.75,12.09) v1(50.75,9.68) v1(51.51,10.95) v1(52.02,12.09) v1(52.15,9.68) v1(52.96,10.96) v1(53.28,12.09) v1(53.29,9.68) v1(54.43,12.09) v1(54.43,11) v1(55.83,9.81) v1(55.96,1.17) v1(56.97,20.6) v1(56.97,19.74) v1(57.22,10.44) v1(58.03,1.17) v1(58.06,20.62) v1(58.06,19.74) v1(58.44,11.84) v1(59.13,19.71) v1(60.08,1.17) v1(61.03,11.2) v1(61.1,9.68) v1(62.14,1.17) v1(62.21,11.2) v1(62.21,9.68) v1(63.66,7.78) v1(64.19,1.17) v1(64.72,20.35) v1(65.61,20.73) v1(65.61,19.94) v1(65.61,7.78) v1(66.23,1.17) v1(66.53,20.35) v1(67.77,7.78)
VCC: length 4.9
  Top Layer w1.524: CN2.1 19,44.88 D5.1
  vias: v1(34.42,37.89) v1(34.42,36.36) v1(34.42,34.84) v1(34.42,33.32) v1(34.42,31.79) v1(34.42,30.27) v1(34.42,28.74) v1(35.69,37.89) v1(35.69,36.36) v1(35.69,34.84) v1(35.69,33.32) v1(35.69,31.79) v1(35.69,30.27) v1(35.69,28.74) v1(36.96,37.89) v1(36.96,36.36) v1(36.96,34.84) v1(36.96,33.32) v1(36.96,31.79) v1(36.96,30.27) v1(36.96,28.74) v1(38.23,37.89) v1(38.23,36.36) v1(38.23,34.84) v1(38.23,33.32) v1(38.23,31.79) v1(38.23,30.27) v1(38.23,28.74) v1(39.5,37.89) v1(39.5,36.36) v1(39.5,34.84) v1(39.5,33.32) v1(39.5,31.79) v1(39.5,30.27) v1(39.5,28.74) v1(40.77,37.89) v1(40.77,36.36) v1(40.77,34.84) v1(40.77,33.32) v1(40.77,31.79) v1(40.77,30.27) v1(40.77,28.74) v1(42.04,37.89) v1(42.04,36.36) v1(42.04,34.84) v1(42.04,33.32) v1(42.04,31.79) v1(42.04,30.27) v1(42.04,28.74) v1(45.09,37.91) v1(45.09,36.39) v1(45.09,34.86) v1(45.09,33.34) v1(45.09,31.81) v1(45.09,30.29) v1(45.09,28.77) v1(46.36,37.91) v1(46.36,36.39) v1(46.36,34.86) v1(46.36,33.34) v1(46.36,31.81) v1(46.36,30.29) v1(46.36,28.77) v1(47.19,17.49) v1(47.19,16.52) v1(47.19,15.55) v1(47.19,14.57) v1(47.63,37.91) v1(47.63,36.39) v1(47.63,34.86) v1(47.63,33.34) v1(47.63,31.81) v1(47.63,30.29) v1(47.63,28.77) v1(48.08,17.49) v1(48.08,16.52) v1(48.08,15.55) v1(48.08,14.57) v1(48.9,37.91) v1(48.9,36.39) v1(48.9,34.86) v1(48.9,33.34) v1(48.9,31.81) v1(48.9,30.29) v1(48.9,28.77) v1(49.22,16.54) v1(49.22,15.52) v1(49.22,14.55) v1(50.17,37.91) v1(50.17,36.39) v1(50.17,34.86) v1(50.17,33.34) v1(50.17,31.81) v1(50.17,30.29) v1(50.17,28.77) v1(50.37,17.49) v1(50.37,16.52) v1(50.37,15.55) v1(50.37,14.57) v1(51.44,37.91) v1(51.44,36.39) v1(51.44,34.86) v1(51.44,33.34) v1(51.44,31.81) v1(51.44,30.29) v1(51.44,28.77) v1(51.35,17.53) v1(51.35,16.56) v1(51.35,15.59) v1(51.35,14.62) v1(52.64,17.49) v1(52.71,37.91) v1(52.71,36.39) v1(52.71,34.86) v1(52.71,33.34) v1(52.71,31.81) v1(52.71,30.29) v1(52.71,28.77) v1(54.05,17.49) v1(54.05,16.52) v1(54.05,15.55) v1(54.05,14.57)
COIL_P: length 26.8
  Bottom Layer w2.54: U1.1 22.13,53.24 17.86,53.24 14.94,50.32 14.94,45.42 13.28,43.77 13.28,38.18 K1.5
  vias: v1(52.96,49.69) v1(52.96,48.17) v1(52.96,46.65) v1(52.96,45.12) v1(52.96,43.6) v1(52.96,42.07) v1(54.23,49.69) v1(54.23,48.17) v1(54.23,46.65) v1(54.23,45.12) v1(54.23,43.6) v1(54.23,42.07) v1(55.5,49.69) v1(55.5,48.17) v1(55.5,46.65) v1(55.5,45.12) v1(55.5,43.6) v1(55.5,42.07) v1(56.77,49.69) v1(56.77,48.17) v1(56.77,46.65) v1(56.77,45.12) v1(56.77,43.6) v1(56.77,42.07) v1(58.04,49.69) v1(58.04,48.17) v1(58.04,46.65) v1(58.04,45.12) v1(58.04,43.6) v1(58.04,42.07) v1(59.31,49.69) v1(59.31,48.17) v1(59.31,46.65) v1(59.31,45.12) v1(59.31,43.6) v1(59.31,42.07) v1(60.58,49.69) v1(60.58,48.17) v1(60.58,46.65) v1(60.58,45.12) v1(60.58,43.6) v1(60.58,42.07)
FAN: length 64.1
  Top Layer w0.762: v1(25.98,25.81) 25.98,15.52 29.67,11.84 v1(32.33,11.84) ; R2.1 20.39,31.52 v1(20.78,31.14)
  Bottom Layer w0.762: v1(25.98,25.81) 25.98,25.93 v1(20.78,31.14) ; H1.3 65.14,13.28 35.81,13.28 34.37,11.84 v1(32.33,11.84)
$1N1844: length 21.8
  Top Layer w3.81: 23.32,33.56 23.32,23.4 L1.1
$1N2254: length 12.4
  Top Layer w0.762: R13.2 v1(35.01,23.4) 35.01,22.7 U3.3 ; R9.1 35.26,17.84 31.7,21.4 v1(31.7,23.4)
  Bottom Layer w0.762: v1(35.01,23.4) v1(31.7,23.4)
$1N2260: length 5.8
  Top Layer w0.762: R6.2 41.21,21.82 D7.2
$1N2269: length 8.2
  Top Layer w0.762: R7.2 R6.1 39.71,24.93 37.27,22.49 U3.1
$1N2296: length 47.9
  Top Layer w0.762: 10.75,34.57 7.06,30.89 ; 10.75,34.57 停止充电.2 ; 10.75,34.57 7.07,30.89 7.06,30.89 ; 7.06,30.89 R12.1 ; R7.1 35.01,26.03 33.22,24.25 33.22,21.37 34.61,19.98 U3.4 ; v1(13.16,32.79) 13.15,32.8 可以充电.1 10.76,34.4
  Bottom Layer w0.762: v1(33.22,24.28) 28.85,24.28 20.34,32.79 v1(13.16,32.79)
$1N2299: length 2.1
  Top Layer w0.762: R14.1 12.37,34.57 停止充电.1
$1N2308: length 1.7
  Top Layer w0.762: R12.2 2.75,32.52 Q2.1
$1N2311: length 1.7
  Top Layer w0.762: 10.76,32.8 10.76,31.15 R11.1
$1N2460: length 27.8
  Top Layer w0.762: K1.4 3,45.66 3,35.55 Q2.3 5.75,34.78 9.85,38.89 14.31,38.89 15.7,37.5 D8.2
$1N22646: length 13.9
  Top Layer w0.762: 66.28,12.56 H1.1 ; 66.28,12.56 66.28,13.75 63.86,16.17 D6.1 ; 66.28,12.56 66.23,12.61 R3.1 63.7,10.07 63.71,10.06 ; 63.71,10.06 63.71,8.84 C25.2 ; 63.71,10.06 R5.2
$1N54290: length 2.8
  Top Layer w0.762: R1.1 63.69,14.1 R3.2
$1N85464: length 22.1
  Top Layer w3.81: L1.2 31.06,18.11 28.9,20.26 28.9,29.6 D2.3 D2.1
  vias: v1(26.74,49.69) v1(26.74,48.16) v1(26.74,46.64) v1(26.74,45.11) v1(26.74,43.59) v1(26.74,42.06) v1(26.74,40.54) v1(28.01,49.69) v1(28.01,48.16) v1(28.01,46.64) v1(28.01,45.11) v1(28.01,43.59) v1(28.01,42.06) v1(28.01,40.54) v1(29.28,49.69) v1(29.28,48.16) v1(29.28,46.64) v1(29.28,45.11) v1(29.28,43.59) v1(29.28,42.06) v1(29.28,40.54) v1(30.55,49.69) v1(30.55,48.16) v1(30.55,46.64) v1(30.55,45.11) v1(30.55,43.59) v1(30.55,42.06) v1(30.55,40.54) v1(31.82,49.69) v1(31.82,48.16) v1(31.82,46.64) v1(31.82,45.11) v1(31.82,43.59) v1(31.82,42.06) v1(31.82,40.54) v1(33.09,49.69) v1(33.09,48.16) v1(33.09,46.64) v1(33.09,45.11) v1(33.09,43.59) v1(33.09,42.06) v1(33.09,40.54) v1(34.36,49.69) v1(34.36,48.16) v1(34.36,46.64) v1(34.36,45.11) v1(34.36,43.59) v1(34.36,42.06) v1(34.36,40.54)
$1N94718: length 5.2
  Top Layer w0.762: R4.1 15.94,32.04 16.46,31.52 R2.2 18.24,33.38 Q1.1
$1N94842: length 16.9
  Top Layer w0.762: D5.2 17.22,38.98 17.22,43.33 15.19,45.37 15.19,47.65 16.06,48.52 CN2.2
  Top Layer w1.524: D5.2 19.12,37.07 Q1.3

## Copper pours and planes (outline as drawn; the poured copper is in the pictures)
GND on Top Layer: -2.97,64.29 72.72,64.29 72.72,-3.4 -2.97,-3.4
GND on Bottom Layer: -2.97,64.29 72.85,64.29 72.85,-3.27 -2.97,-3.27
VCC on Top Layer: 49.35,5.44 48.86,5.93 45.48,5.93 41.73,9.68 41.73,11.95 43.52,13.74 58.11,13.74 59.44,15.07 61.59,15.07 62.18,15.65 62.18,16.67 60.65,18.19 40.44,18.19 36.14,13.89 36.14,2.23 37.24,1.13 48.62,1.13 49.35,1.87
VCC on Top Layer: 33.6,28.38 34.16,27.59 53.06,27.59 53.73,28.26 53.73,38.58 53.29,39.02 33.98,39.02 33.6,38.64
VCC on Bottom Layer: 42.75,27.59 43.51,28.35 43.51,38 42.49,39.02 25.98,39.02 22.68,42.32 22.68,44.8 20.21,47.27 17.09,47.27 16.59,46.76 16.59,43.59 19.12,41.05 19.12,40.03 31.57,27.59
VCC on Bottom Layer: 41.35,39.02 53.92,39.02 54.69,38.25 54.69,14.6 53.83,13.74 47.19,13.74 46.56,14.38 46.56,24.28 43.25,27.59 42.24,27.59 41.35,28.48
VCCO on Top Layer: 51.6,18.41 52.91,19.71 52.91,21.75 52.27,22.38 48.84,22.38 47.7,23.52 46.81,23.52 46.18,22.89 44.06,22.89 42.78,21.61 42.78,19.43 43.8,18.41
COIL_N on Top Layer: 54.94,55.91 54.94,58.96 54.43,59.46 18.87,59.46 10.87,51.46 10.87,48.8 11.25,48.42 15.31,48.42 24.4,57.5 25.74,57.5 27.84,55.4 54.43,55.4
COIL_P on Top Layer: 65.35,22.13 65.35,50.07 64.84,50.57 52.02,50.57 51.64,50.19 51.64,40.29 52.15,39.78 54.12,39.78 56.56,37.34 56.56,30.16 58.11,28.6 58.11,22 59,21.11 64.34,21.11
COIL_P on Bottom Layer: 48.21,41.56 61.42,41.56 62.43,42.57 62.43,50.83 55.38,57.88 23.44,57.88 22.68,57.13 22.68,52.73 24.97,50.45 46.75,50.45 47.62,49.17 47.62,42.14
$1N1844 on Top Layer: 30.14,54.93 25.64,54.93 21.28,50.57 21.28,18.73 25.35,22.79 25.35,50.32 25.86,50.83 30.26,50.83 30.51,51.08 30.51,54.55
$1N1844 on Top Layer: 67.47,54.93 70.05,52.35 70.05,21.76 69.44,21.15 66.71,21.15 65.73,22.13 65.73,50.45 65.35,50.83 28.52,50.83 27.89,51.46 27.89,54.13 28.69,54.93
$1N1844 on Top Layer: 23.82,29.11 25.35,29.11 25.35,24.79 23.82,24.79
$1N85464 on Top Layer: 28.9,21.62 31.95,24.67 31.95,38.38 33.35,39.78 35,39.78 35,41.32 34.51,41.8 27.88,41.8 25.98,39.8 25.98,26.32 26.24,26.06 26.24,24.28

Small or netless copper shapes (teardrops, artwork), in the pictures only: 55 on Top Layer, 3 on Bottom Layer

## Text on the board
Bottom Silkscreen Layer: 无线充电接收端
Top Layer: 2025-4-25 | 山东工 / 商学院 | 电子电 / 磁一队
Top Silkscreen Layer: ADC | 5V | FAN | G | GND | VCC | 接收线圈 | 注意高温！ | 高压危险！
